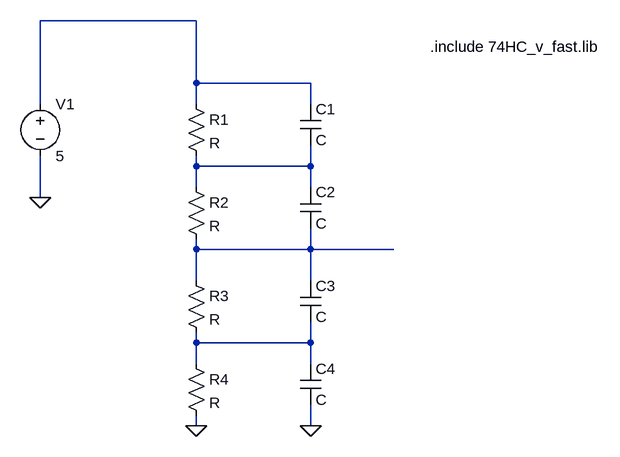
[diagram p0: schematic Refrence Generator.asc]
Refrence Generator.asc, the LTspice schematic file:
Version 4
SHEET 1 924 680
WIRE 288 -32 48 -32
WIRE 288 64 288 -32
WIRE 464 64 288 64
WIRE 48 96 48 -32
WIRE 288 96 288 64
WIRE 464 96 464 64
WIRE 288 192 288 176
WIRE 464 192 464 160
WIRE 464 192 288 192
WIRE 288 224 288 192
WIRE 464 224 464 192
WIRE 48 240 48 176
WIRE 288 320 288 304
WIRE 464 320 464 288
WIRE 464 320 288 320
WIRE 592 320 464 320
WIRE 288 368 288 320
WIRE 464 368 464 320
WIRE 288 464 288 448
WIRE 464 464 464 432
WIRE 464 464 288 464
WIRE 288 496 288 464
WIRE 464 496 464 464
WIRE 288 592 288 576
WIRE 464 592 464 560
FLAG 288 592 0
FLAG 464 592 0
FLAG 48 240 0
SYMBOL voltage 48 80 R0
WINDOW 123 0 0 Left 0
WINDOW 39 0 0 Left 0
SYMATTR InstName V1
SYMATTR Value 5
SYMBOL res 272 80 R0
SYMATTR InstName R1
SYMBOL res 272 208 R0
SYMATTR InstName R2
SYMBOL res 272 352 R0
SYMATTR InstName R3
SYMBOL res 272 480 R0
SYMATTR InstName R4
SYMBOL cap 448 96 R0
SYMATTR InstName C1
SYMBOL cap 448 224 R0
SYMATTR InstName C2
SYMBOL cap 448 368 R0
SYMATTR InstName C3
SYMBOL cap 448 496 R0
SYMATTR InstName C4
TEXT 648 8 Left 2 !.include 74HC_v_fast.lib

The netlist it stands for:
* Refrence Generator.asc
V1 N001 0 5
R1 N001 N002 R
R2 N002 N003 R
R3 N003 N004 R
R4 N004 0 R
C1 N001 N002 C
C2 N002 N003 C
C3 N003 N004 C
C4 N004 0 C
.include 74HC_v_fast.lib
.backanno
.end